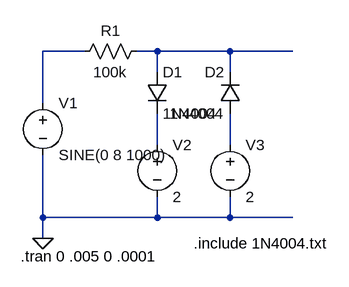
[diagram p0: schematic Lab4Pre2.asc]
Lab4Pre2.asc, the LTspice schematic file:
Version 4
SHEET 1 880 680
WIRE 96 80 32 80
WIRE 208 80 176 80
WIRE 320 80 208 80
WIRE 416 80 320 80
WIRE 208 112 208 80
WIRE 320 112 320 80
WIRE 32 160 32 80
WIRE 208 224 208 176
WIRE 320 224 320 176
WIRE 32 336 32 240
WIRE 208 336 208 304
WIRE 208 336 32 336
WIRE 320 336 320 304
WIRE 320 336 208 336
WIRE 416 336 320 336
WIRE 32 368 32 336
FLAG 32 368 0
SYMBOL voltage 32 144 R0
WINDOW 123 0 0 Left 2
WINDOW 39 0 0 Left 2
SYMATTR InstName V1
SYMATTR Value SINE(0 8 1000)
SYMBOL voltage 208 208 R0
WINDOW 123 0 0 Left 2
WINDOW 39 0 0 Left 2
SYMATTR InstName V2
SYMATTR Value 2
SYMBOL voltage 320 208 R0
WINDOW 123 0 0 Left 2
WINDOW 39 0 0 Left 2
SYMATTR InstName V3
SYMATTR Value 2
SYMBOL res 192 64 R90
WINDOW 0 0 56 VBottom 2
WINDOW 3 32 56 VTop 2
SYMATTR InstName R1
SYMATTR Value 100k
SYMBOL diode 192 112 R0
SYMATTR InstName D1
SYMATTR Value 1N4004
SYMBOL diode 336 176 R180
WINDOW 0 24 64 Left 2
WINDOW 3 24 0 Left 2
SYMATTR InstName D2
SYMATTR Value 1N4004
TEXT 264 376 Left 2 !.include 1N4004.txt
TEXT -2 396 Left 2 !.tran 0 .005 0 .0001

The netlist it stands for:
* Lab4Pre2.asc
V1 N001 0 SINE(0 8 1000)
V2 N003 0 2
V3 N004 0 2
R1 N002 N001 100k
D1 N002 N003 1N4004
D2 N004 N002 1N4004
.model D D
.lib standard.dio
.include 1N4004.txt
.tran 0 .005 0 .0001
.backanno
.end